# Altium schematic sheet Spannungsteiler_low.SchDoc
size A4; CompanyName: Technische Hochschule Nürnberg Georg Simon Ohm; Address1: Fürther Straße 250; Address2: 90429 Nürnberg; Address3: GERMANY; SheetNumber: 5; SheetTotal: 6; CompanyName2: Institut ELSYS
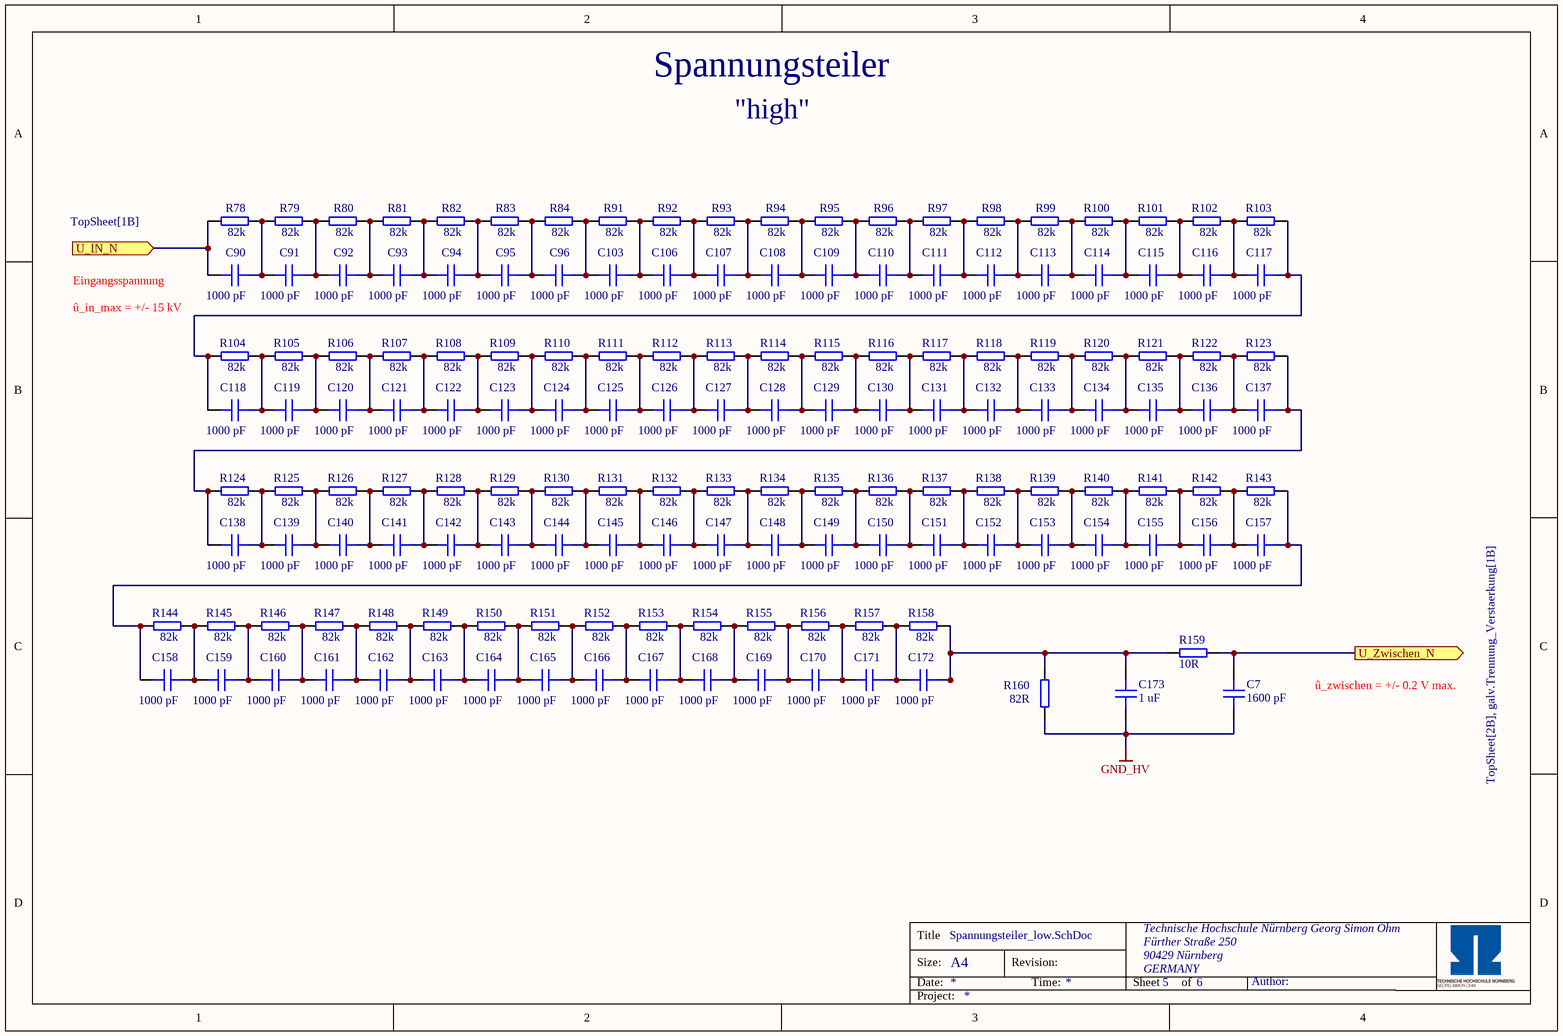
[diagram p0: Spannungsteiler_low.SchDoc]

## Parts
C7  1600 pF  [C_1206]
C90  1000 pF  [C_1206]
C91  1000 pF  [C_1206]
C92  1000 pF  [C_1206]
C93  1000 pF  [C_1206]
C94  1000 pF  [C_1206]
C95  1000 pF  [C_1206]
C96  1000 pF  [C_1206]
C103  1000 pF  [C_1206]
C106  1000 pF  [C_1206]
C107  1000 pF  [C_1206]
C108  1000 pF  [C_1206]
C109  1000 pF  [C_1206]
C110  1000 pF  [C_1206]
C111  1000 pF  [C_1206]
C112  1000 pF  [C_1206]
C113  1000 pF  [C_1206]
C114  1000 pF  [C_1206]
C115  1000 pF  [C_1206]
C116  1000 pF  [C_1206]
C117  1000 pF  [C_1206]
C118  1000 pF  [C_1206]
C119  1000 pF  [C_1206]
C120  1000 pF  [C_1206]
C121  1000 pF  [C_1206]
C122  1000 pF  [C_1206]
C123  1000 pF  [C_1206]
C124  1000 pF  [C_1206]
C125  1000 pF  [C_1206]
C126  1000 pF  [C_1206]
C127  1000 pF  [C_1206]
C128  1000 pF  [C_1206]
C129  1000 pF  [C_1206]
C130  1000 pF  [C_1206]
C131  1000 pF  [C_1206]
C132  1000 pF  [C_1206]
C133  1000 pF  [C_1206]
C134  1000 pF  [C_1206]
C135  1000 pF  [C_1206]
C136  1000 pF  [C_1206]
C137  1000 pF  [C_1206]
C138  1000 pF  [C_1206]
C139  1000 pF  [C_1206]
C140  1000 pF  [C_1206]
C141  1000 pF  [C_1206]
C142  1000 pF  [C_1206]
C143  1000 pF  [C_1206]
C144  1000 pF  [C_1206]
C145  1000 pF  [C_1206]
C146  1000 pF  [C_1206]
C147  1000 pF  [C_1206]
C148  1000 pF  [C_1206]
C149  1000 pF  [C_1206]
C150  1000 pF  [C_1206]
C151  1000 pF  [C_1206]
C152  1000 pF  [C_1206]
C153  1000 pF  [C_1206]
C154  1000 pF  [C_1206]
C155  1000 pF  [C_1206]
C156  1000 pF  [C_1206]
C157  1000 pF  [C_1206]
C158  1000 pF  [C_1206]
C159  1000 pF  [C_1206]
C160  1000 pF  [C_1206]
C161  1000 pF  [C_1206]
C162  1000 pF  [C_1206]
C163  1000 pF  [C_1206]
C164  1000 pF  [C_1206]
C165  1000 pF  [C_1206]
C166  1000 pF  [C_1206]
C167  1000 pF  [C_1206]
C168  1000 pF  [C_1206]
C169  1000 pF  [C_1206]
C170  1000 pF  [C_1206]
C171  1000 pF  [C_1206]
C172  1000 pF  [C_1206]
C173  1 uF  [C_1206]
R78  82k  [RES 1206_3216]
R79  82k  [RES 1206_3216]
R80  82k  [RES 1206_3216]
R81  82k  [RES 1206_3216]
R82  82k  [RES 1206_3216]
R83  82k  [RES 1206_3216]
R84  82k  [RES 1206_3216]
R91  82k  [RES 1206_3216]
R92  82k  [RES 1206_3216]
R93  82k  [RES 1206_3216]
R94  82k  [RES 1206_3216]
R95  82k  [RES 1206_3216]
R96  82k  [RES 1206_3216]
R97  82k  [RES 1206_3216]
R98  82k  [RES 1206_3216]
R99  82k  [RES 1206_3216]
R100  82k  [RES 1206_3216]
R101  82k  [RES 1206_3216]
R102  82k  [RES 1206_3216]
R103  82k  [RES 1206_3216]
R104  82k  [RES 1206_3216]
R105  82k  [RES 1206_3216]
R106  82k  [RES 1206_3216]
R107  82k  [RES 1206_3216]
R108  82k  [RES 1206_3216]
R109  82k  [RES 1206_3216]
R110  82k  [RES 1206_3216]
R111  82k  [RES 1206_3216]
R112  82k  [RES 1206_3216]
R113  82k  [RES 1206_3216]
R114  82k  [RES 1206_3216]
R115  82k  [RES 1206_3216]
R116  82k  [RES 1206_3216]
R117  82k  [RES 1206_3216]
R118  82k  [RES 1206_3216]
R119  82k  [RES 1206_3216]
R120  82k  [RES 1206_3216]
R121  82k  [RES 1206_3216]
R122  82k  [RES 1206_3216]
R123  82k  [RES 1206_3216]
R124  82k  [RES 1206_3216]
R125  82k  [RES 1206_3216]
R126  82k  [RES 1206_3216]
R127  82k  [RES 1206_3216]
R128  82k  [RES 1206_3216]
R129  82k  [RES 1206_3216]
R130  82k  [RES 1206_3216]
R131  82k  [RES 1206_3216]
R132  82k  [RES 1206_3216]
R133  82k  [RES 1206_3216]
R134  82k  [RES 1206_3216]
R135  82k  [RES 1206_3216]
R136  82k  [RES 1206_3216]
R137  82k  [RES 1206_3216]
R138  82k  [RES 1206_3216]
R139  82k  [RES 1206_3216]
R140  82k  [RES 1206_3216]
R141  82k  [RES 1206_3216]
R142  82k  [RES 1206_3216]
R143  82k  [RES 1206_3216]
R144  82k  [RES 1206_3216]
R145  82k  [RES 1206_3216]
R146  82k  [RES 1206_3216]
R147  82k  [RES 1206_3216]
R148  82k  [RES 1206_3216]
R149  82k  [RES 1206_3216]
R150  82k  [RES 1206_3216]
R151  82k  [RES 1206_3216]
R152  82k  [RES 1206_3216]
R153  82k  [RES 1206_3216]
R154  82k  [RES 1206_3216]
R155  82k  [RES 1206_3216]
R156  82k  [RES 1206_3216]
R157  82k  [RES 1206_3216]
R158  82k  [RES 1206_3216]
R159  10R  [RES 0603_1608]
R160  82R  [RES 1206_3216]

## Ports
U_IN_N (in, see TopSheet[1B]), U_Zwischen_N (out, see TopSheet[2B], galv.Trennung_Verstaerkung[1B])

## Nets
GND_HV: C7.1 C173.1 R160.1
U_IN_N: C90.1 R78.1 ; port U_IN_N
U_Zwischen_N: C7.2 R159.2 ; port U_Zwischen_N
NetC90_2: C90.2 C91.1 R78.2 R79.1
NetC91_2: C91.2 C92.1 R79.2 R80.1
NetC92_2: C92.2 C93.1 R80.2 R81.1
NetC93_2: C93.2 C94.1 R81.2 R82.1
NetC94_2: C94.2 C95.1 R82.2 R83.1
NetC95_2: C95.2 C96.1 R83.2 R84.1
NetC96_2: C96.2 C103.1 R84.2 R91.1
NetC103_2: C103.2 C106.1 R91.2 R92.1
NetC106_2: C106.2 C107.1 R92.2 R93.1
NetC107_2: C107.2 C108.1 R93.2 R94.1
NetC108_2: C108.2 C109.1 R94.2 R95.1
NetC109_2: C109.2 C110.1 R95.2 R96.1
NetC110_2: C110.2 C111.1 R96.2 R97.1
NetC111_2: C111.2 C112.1 R97.2 R98.1
NetC112_2: C112.2 C113.1 R98.2 R99.1
NetC113_2: C113.2 C114.1 R99.2 R100.1
NetC114_2: C114.2 C115.1 R100.2 R101.1
NetC115_2: C115.2 C116.1 R101.2 R102.1
NetC116_2: C116.2 C117.1 R102.2 R103.1
NetC117_2: C117.2 C118.1 R103.2 R104.1
NetC118_2: C118.2 C119.1 R104.2 R105.1
NetC119_2: C119.2 C120.1 R105.2 R106.1
NetC120_2: C120.2 C121.1 R106.2 R107.1
NetC121_2: C121.2 C122.1 R107.2 R108.1
NetC122_2: C122.2 C123.1 R108.2 R109.1
NetC123_2: C123.2 C124.1 R109.2 R110.1
NetC124_2: C124.2 C125.1 R110.2 R111.1
NetC125_2: C125.2 C126.1 R111.2 R112.1
NetC126_2: C126.2 C127.1 R112.2 R113.1
NetC127_2: C127.2 C128.1 R113.2 R114.1
NetC128_2: C128.2 C129.1 R114.2 R115.1
NetC129_2: C129.2 C130.1 R115.2 R116.1
NetC130_2: C130.2 C131.1 R116.2 R117.1
NetC131_2: C131.2 C132.1 R117.2 R118.1
NetC132_2: C132.2 C133.1 R118.2 R119.1
NetC133_2: C133.2 C134.1 R119.2 R120.1
NetC134_2: C134.2 C135.1 R120.2 R121.1
NetC135_2: C135.2 C136.1 R121.2 R122.1
NetC136_2: C136.2 C137.1 R122.2 R123.1
NetC137_2: C137.2 C138.1 R123.2 R124.1
NetC138_2: C138.2 C139.1 R124.2 R125.1
NetC139_2: C139.2 C140.1 R125.2 R126.1
NetC140_2: C140.2 C141.1 R126.2 R127.1
NetC141_2: C141.2 C142.1 R127.2 R128.1
NetC142_2: C142.2 C143.1 R128.2 R129.1
NetC143_2: C143.2 C144.1 R129.2 R130.1
NetC144_2: C144.2 C145.1 R130.2 R131.1
NetC145_2: C145.2 C146.1 R131.2 R132.1
NetC146_2: C146.2 C147.1 R132.2 R133.1
NetC147_2: C147.2 C148.1 R133.2 R134.1
NetC148_2: C148.2 C149.1 R134.2 R135.1
NetC149_2: C149.2 C150.1 R135.2 R136.1
NetC150_2: C150.2 C151.1 R136.2 R137.1
NetC151_2: C151.2 C152.1 R137.2 R138.1
NetC152_2: C152.2 C153.1 R138.2 R139.1
NetC153_2: C153.2 C154.1 R139.2 R140.1
NetC154_2: C154.2 C155.1 R140.2 R141.1
NetC155_2: C155.2 C156.1 R141.2 R142.1
NetC156_2: C156.2 C157.1 R142.2 R143.1
NetC157_2: C157.2 C158.1 R143.2 R144.1
NetC158_2: C158.2 C159.1 R144.2 R145.1
NetC159_2: C159.2 C160.1 R145.2 R146.1
NetC160_2: C160.2 C161.1 R146.2 R147.1
NetC161_2: C161.2 C162.1 R147.2 R148.1
NetC162_2: C162.2 C163.1 R148.2 R149.1
NetC163_2: C163.2 C164.1 R149.2 R150.1
NetC164_2: C164.2 C165.1 R150.2 R151.1
NetC165_2: C165.2 C166.1 R151.2 R152.1
NetC166_2: C166.2 C167.1 R152.2 R153.1
NetC167_2: C167.2 C168.1 R153.2 R154.1
NetC168_2: C168.2 C169.1 R154.2 R155.1
NetC169_2: C169.2 C170.1 R155.2 R156.1
NetC170_2: C170.2 C171.1 R156.2 R157.1
NetC171_2: C171.2 C172.1 R157.2 R158.1
NetC172_2: C172.2 C173.2 R158.2 R159.1 R160.2

## Notes on the sheet
- Spannungsteiler
- "high"
- Eingangsspannung
- û_in_max = +/- 15 kV
- û_zwischen = +/- 0.2 V max.
- Title
- Size:
- Date:
- A4
- Revision:
- Time:
- Sheet
- of
- Author:
- Project:

## Library data of the parts
C7 = C1206C162K3HACTU: Capacitor 1206, 25V, 1600pF, X8R, 10%; Manufacturer: KEMET; Tolerance: 12 %; Voltage Rating: 25 VDC; Created from: TGaupp; Manufacturer Part Number: C1206C162K3HACTU; PartID: 136; Created On: 08.08.2023 12:37:56; ComponentLink1Description: Datasheet; ComponentLink1URL: https://www.mouser.de/datasheet/2/212/KEM_C1007_X8R_ULTRA_150C_SMD-1102703.pdf; Component Type: Capacitor 1206; Device Package: 1206; Last Updated: 08.08.2023 12:37:56; Mounting Type: SMD; Operating Temperature: -55 - 125°C; Series: SMD Comm X8R HT150C; Supplier 1: Mouser; Supplier Part Number 1: 80-C1206C162K3HACTU; Type: Capacitor; Value: 1600 pF; Live Cycle Status: 1; Stock number: not stored
C90-C96 C103 C106-C172 = C1206C102J2GACTU: Capacitor 1206, 200VDC, 1000pF, C0G, 5%; Manufacturer: KEMET; Created from: TGaupp; Supplier 1: Mouser; Supplier Part Number 1: 80-C1206C102J2G; Value: 1000 pF; Manufacturer Part Number: C1206C102J2GACTU; PartID: 135; Created On: 08.08.2023 10:37:32; ComponentLink1Description: Datasheet; ComponentLink1URL: https://www.mouser.de/datasheet/2/212/KEM_C1003_C0G_SMD-1101588.pdf; Component Type: Capacitor 1206; Device Package: 1206; Last Updated: 08.08.2023 10:37:39; Mounting Type: SMD; Operating Temperature: -55 - 125°C; Series: SMD Comm C0G; Type: Capacitor; Tolerance: 5 %; Voltage Rating: 200 VDC; Live Cycle Status: 1; LCSC Part Number: C2167363; Stock number: not stored
C173 = C1206X105J5RACTU: Capacitor 1206, 50V, 1uF, X7R, 5%; Manufacturer: KEMET; Voltage Rating: 50 VDC; Created from: TGaupp; Manufacturer Part Number: C1206X105J5RACTU; PartID: 137; Created On: 28.08.2023 09:04:24; ComponentLink1Description: Datasheet; ComponentLink1URL: https://www.mouser.de/datasheet/2/212/1/KEM_C1013_X7R_FT_CAP_SMD-1103280.pdf; Component Type: Capacitor 1206; Device Package: 1206; Last Updated: 28.08.2023 09:04:24; Mounting Type: SMD; Operating Temperature: -55 - 125°C; Series: SMD Comm X7R Flex; Supplier 1: Mouser; Supplier Part Number 1: 80-C1206X105J5RACTU; Type: Capacitor; Tolerance: 5 %; Value: 1 uF; Live Cycle Status: 1; Stock number: not stored
R78-R84 R91-R158 = TNPW120682K0BEEA: SMD resistor 82Kohms .1% 25ppm; Manufacturer: Vishay; Tolerance: 0.1%; Created from: TGaupp; Supplier 1: Mouser; Supplier Part Number 1: 71-TNPW120682K0BEEA; Value: 82k; Manufacturer Part Number: TNPW120682K0BEEA; PartID: 290; Created On: 08.08.2023 09:29:01; ComponentLink1Description: Datasheet; ComponentLink1URL: https://www.vishay.com/docs/28758/tnpw_e3.pdf; Component Type: SMD resistor; Device Package: 1206; Last Updated: 08.08.2023 09:29:01; Mounting Type: SMD; Type: Resistor; Live Cycle Status: 1; Stock number: not stored; LCSC Part Number: C2089369
R159 = CRCW060310R0FKTA: SMD 1/10watt 10ohms 1%; Manufacturer: Vishay; Created from: TGaupp; Manufacturer Part Number: CRCW060310R0FKTA; PartID: 296; Created On: 28.08.2023 12:16:52; ComponentLink1Description: Datasheet; ComponentLink1URL: https://www.vishay.com/docs/20008/dcrcw.pdf; Component Type: SMD resistor; Device Package: 0603; Last Updated: 28.08.2023 12:16:52; Mounting Type: SMD; Supplier 1: Mouser; Supplier Part Number 1: 71-CRCW0603-10; Type: Resistor; Tolerance: 1 %; Value: 10R; Live Cycle Status: 1; Stock number: not stored; LCSC Part Number: C2091419
R160 = RT1206BRD0782RL: SMD resistor 1/4W 82 ohm .1% 25ppm; Manufacturer: YAGEO; Tolerance: 0.1%; Created from: TGaupp; Supplier 1: Mouser; Supplier Part Number 1: 603-RT1206BRD0782RL; Value: 82R; Manufacturer Part Number: RT1206BRD0782RL; PartID: 291; Created On: 08.08.2023 10:07:21; ComponentLink1Description: Datasheet; ComponentLink1URL: https://www.mouser.de/datasheet/2/447/PYu_RT_1_to_0_01_RoHS_L_12-3003070.pdf; Component Type: SMD resistor; Device Package: 1206; Last Updated: 08.08.2023 10:07:21; Mounting Type: SMD; Type: Resistor; Live Cycle Status: 1; Stock number: not stored; LCSC Part Number: C870908